# Altium schematic sheet wishbone_adder.SchDoc
size A4
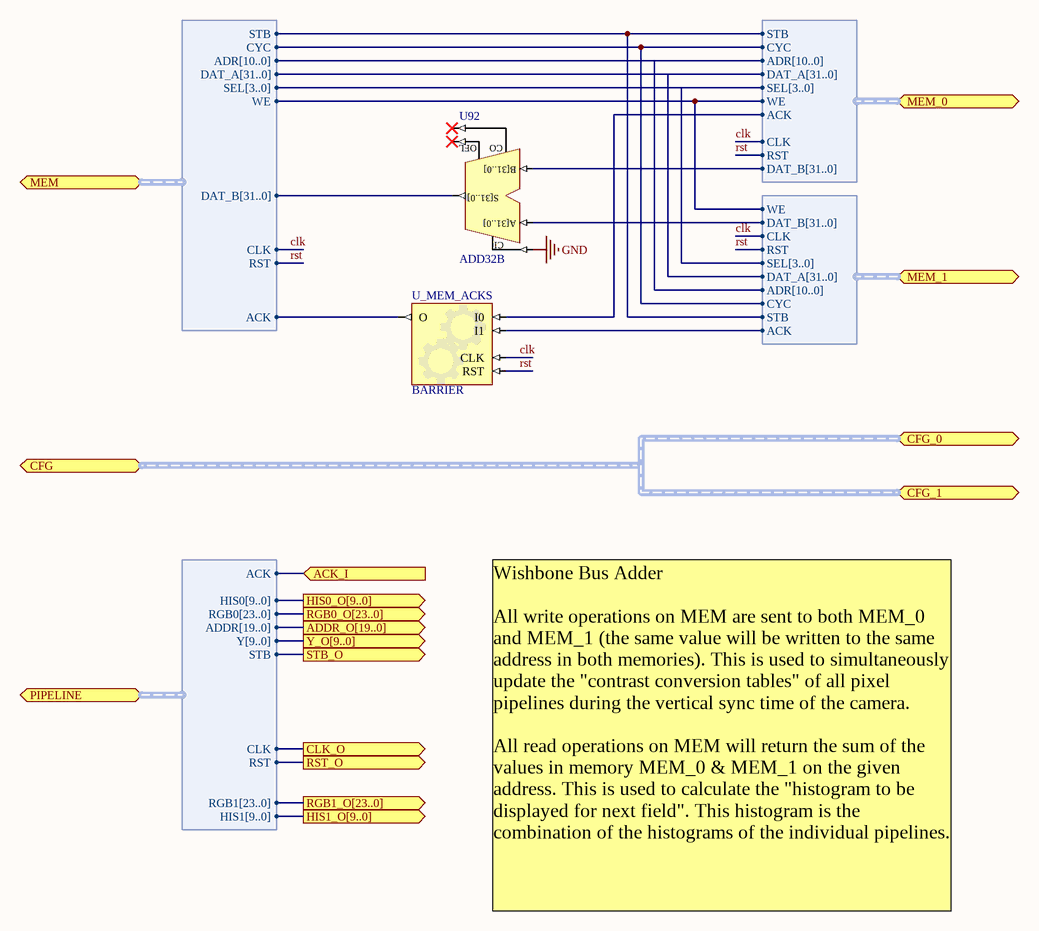
[diagram p0: wishbone_adder.SchDoc]

## Parts
U92  ADD32B
U_MEM_ACKS  BARRIER

## Ports
ACK_I (in), ADDR_O[19..0] (out), CFG (harness H_CFG), CFG_0 (harness H_CFG), CFG_1 (harness H_CFG), CLK_O (out), HIS0_O[9..0] (out), HIS1_O[9..0] (out), MEM (harness WB_A11DAB32S), MEM_0 (harness WB_A11DAB32S), MEM_1 (harness WB_A11DAB32S), PIPELINE (harness H_PIXEL_PIPELINE_2_6), RGB0_O[23..0] (out), RGB1_O[23..0] (out), RST_O (out), STB_O (out), Y_O[9..0] (out)

## Harnesses
WB_A11DAB32S: STB, CYC, ACK, ADR[10..0], DAT_B[31..0], DAT_A[31..0], SEL[3..0], WE, CLK, RST
WB_A11DAB32S: STB, CYC, ACK, ADR[10..0], DAT_B[31..0], DAT_A[31..0], SEL[3..0], RST, WE, CLK
H_PIXEL_PIPELINE_2_6: RGB0[23..0], HIS0[9..0], ADDR[19..0], Y[9..0], HIS1[9..0], RGB1[23..0], STB, ACK, CLK, RST

## Nets
GND: U92.CI
ACK_I: port ACK_I, port PIPELINE.ACK
clk: U_MEM_ACKS.CLK ; port MEM.CLK, port MEM_0.CLK, port MEM_1.CLK
CLK_O: port CLK_O, port PIPELINE.CLK
rst: U_MEM_ACKS.RST ; port MEM.RST, port MEM_0.RST, port MEM_1.RST
RST_O: port RST_O, port PIPELINE.RST
STB_O: port STB_O, port PIPELINE.STB
NetU92_A[31..0]: U92.A[31..0] ; port MEM_1.DAT_B[31..0]
NetU92_B[31..0]: U92.B[31..0] ; port MEM_0.DAT_B[31..0]
NetU92_S[31..0]: U92.S[31..0] ; port MEM.DAT_B[31..0]
NetU_MEM_ACKS_I0: U_MEM_ACKS.I0 ; port MEM_0.ACK
NetU_MEM_ACKS_I1: U_MEM_ACKS.I1 ; port MEM_1.ACK
NetU_MEM_ACKS_O: U_MEM_ACKS.O ; port MEM.ACK
(unnamed): port MEM.STB, port MEM_0.STB, port MEM_1.STB
(unnamed): port MEM.CYC, port MEM_0.CYC, port MEM_1.CYC
(unnamed): port MEM.WE, port MEM_0.WE, port MEM_1.WE

Not connected (* = marked no-connect by the designer): U92 CO* OFL*

## Buses and harness runs
harness port CFG = port CFG_0 = port CFG_1

## Notes on the sheet
- Wishbone Bus Adder
  All write operations on MEM are sent to both MEM_0 and MEM_1 (the same value will be written to the same address in both memories). This is used to simultaneously update the "contrast conversion tables" of all pixel pipelines during the vertical sync time of the camera.
  All read operations on MEM will return the sum of the values in memory MEM_0 & MEM_1 on the given address. This is used to calculate the "histogram to be displayed for next field". This histogram is the combination of the histograms of the individual pipelines.

## Library data of the parts
U92 = ADD32B: 32-Bit Cascadable Full Adder with Signed and Unsigned Operations, Bus Version; FunctionalClass: Arithmetic Function; SubClass: ADD; PortSize: 32; ArchiveName: GENERIC; VHDLIB_SIM: GENERIC_LIB; Published: 31-May-2004; Publisher: Altium Limited; LastRevisionNo: 1.00.00; HelpURL: CR0118 FPGA Generic Library Guide.pdf#page=98; ComponentLink1URL: CR0124 FPGA Arithmetic Function Resource Usage.pdf#page=18; ComponentLink1Description: Core &Resource Usage; PortStyle: Bus Version
U_MEM_ACKS = BARRIER: Configurable Barrier; ConfiguratorName: GENERIC_BARRIER; ConfigurationParameters: {}Version[1.0]{}Option_BusInput[False]{}Option_BarrierOutputType[Normal]{}Option_RegisterOutputs[False]{}Option_NegativeClockEdge[False]{}Option_InputCount[2]{}InputInvert0[False]{}InputInvert1[False]{}; HelpURL: https://wiki.altium.com/display/ADOH/Configurable+Generic+Library; LastRevisionNo: 1.00.00; Published: 29-Apr-2010; Publisher: Altium Limited